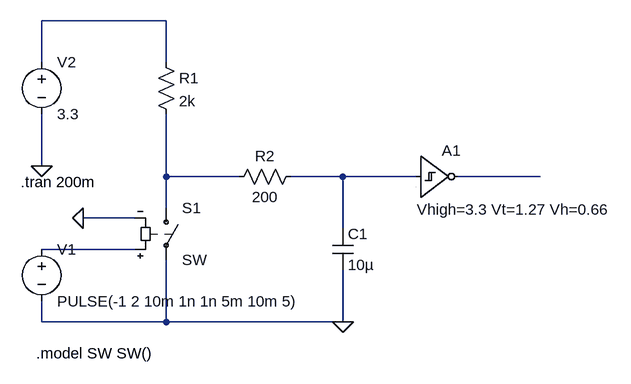
[diagram p0: schematic Schmitt Trigger Debounce Button.asc]
Schmitt Trigger Debounce Button.asc, the LTspice schematic file:
Version 4
SHEET 1 880 680
WIRE 144 80 -48 80
WIRE -48 144 -48 80
WIRE 144 144 144 80
WIRE -48 304 -48 224
WIRE 144 320 144 224
WIRE 256 320 144 320
WIRE 416 320 336 320
WIRE 528 320 416 320
WIRE 720 320 592 320
WIRE 144 368 144 320
WIRE 96 384 16 384
WIRE 416 400 416 320
WIRE 96 432 -48 432
WIRE -48 544 -48 512
WIRE 144 544 144 448
WIRE 144 544 -48 544
WIRE 416 544 416 464
WIRE 416 544 144 544
FLAG -48 304 0
FLAG 416 544 0
FLAG 16 384 0
SYMBOL res 128 128 R0
SYMATTR InstName R1
SYMATTR Value 2k
SYMBOL res 352 304 R90
WINDOW 0 0 56 VBottom 2
WINDOW 3 32 56 VTop 2
SYMATTR InstName R2
SYMATTR Value 200
SYMBOL cap 400 400 R0
SYMATTR InstName C1
SYMATTR Value 10µ
SYMBOL sw 144 352 R0
SYMATTR InstName S1
SYMBOL voltage -48 416 R0
WINDOW 123 0 0 Left 0
WINDOW 39 0 0 Left 0
SYMATTR InstName V1
SYMATTR Value PULSE(-1 2 10m 1n 1n 5m 10m 5)
SYMBOL voltage -48 128 R0
WINDOW 123 0 0 Left 0
WINDOW 39 0 0 Left 0
SYMATTR InstName V2
SYMATTR Value 3.3
SYMBOL Digital\\schmtinv 528 256 R0
WINDOW 3 2 115 Left 2
SYMATTR InstName A1
SYMATTR Value Vhigh=3.3 Vt=1.27 Vh=0.66
TEXT -80 328 Left 2 !.tran 200m
TEXT -56 592 Left 2 !.model SW SW()

The netlist it stands for:
* Schmitt Trigger Debounce Button.asc
R1 N001 N002 2k
R2 N003 N002 200
C1 N003 0 10µ
S1 N002 0 N005 0 SW
V1 N005 0 PULSE(-1 2 10m 1n 1n 5m 10m 5)
V2 N001 0 3.3
A1 N003 0 0 0 0 N004 0 0 SCHMITT Vhigh=3.3 Vt=1.27 Vh=0.66
.tran 200m
.model SW SW()
.backanno
.end